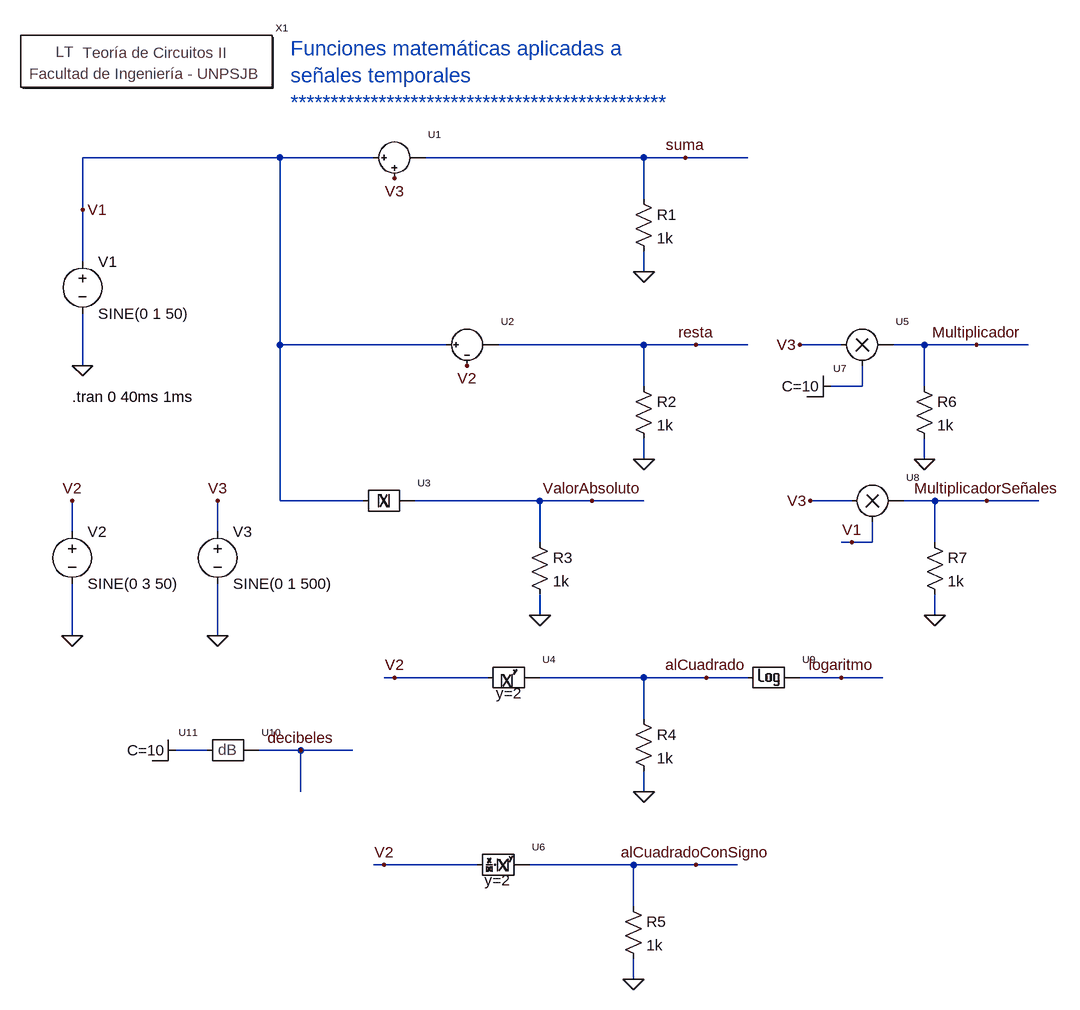
[diagram p0: schematic Prueba de funciones matematicas.asc]
Prueba de funciones matematicas.asc, the LTspice schematic file:
Version 4
SHEET 1 1132 1172
WIRE -256 -496 -560 -496
WIRE -112 -496 -256 -496
WIRE 304 -496 -32 -496
WIRE 368 -496 304 -496
WIRE 464 -496 368 -496
WIRE 304 -432 304 -496
WIRE -560 -416 -560 -496
WIRE -560 -336 -560 -416
WIRE 304 -320 304 -352
WIRE -256 -208 -256 -496
WIRE 0 -208 -256 -208
WIRE 304 -208 80 -208
WIRE 384 -208 304 -208
WIRE 464 -208 384 -208
WIRE 608 -208 544 -208
WIRE 736 -208 688 -208
WIRE 816 -208 736 -208
WIRE 896 -208 816 -208
WIRE -560 -176 -560 -256
WIRE 304 -144 304 -208
WIRE 640 -144 640 -176
WIRE 640 -144 592 -144
WIRE 736 -144 736 -208
WIRE 304 -32 304 -64
WIRE 736 -32 736 -64
WIRE -256 32 -256 -208
WIRE -128 32 -256 32
WIRE 144 32 -48 32
WIRE 224 32 144 32
WIRE 304 32 224 32
WIRE 624 32 560 32
WIRE 752 32 704 32
WIRE 832 32 752 32
WIRE 912 32 832 32
WIRE -576 80 -576 32
WIRE -352 80 -352 32
WIRE 144 96 144 32
WIRE 624 96 608 96
WIRE 656 96 656 64
WIRE 656 96 624 96
WIRE 752 96 752 32
WIRE 144 208 144 176
WIRE 752 208 752 176
WIRE -576 240 -576 160
WIRE -352 240 -352 160
WIRE -80 304 -96 304
WIRE 64 304 -80 304
WIRE 304 304 144 304
WIRE 400 304 304 304
WIRE 464 304 400 304
WIRE 608 304 544 304
WIRE 672 304 608 304
WIRE 304 368 304 304
WIRE -368 416 -416 416
WIRE -224 416 -288 416
WIRE -144 416 -224 416
WIRE -224 480 -224 416
WIRE 304 480 304 448
WIRE -96 592 -112 592
WIRE 48 592 -96 592
WIRE 288 592 128 592
WIRE 384 592 288 592
WIRE 448 592 384 592
WIRE 288 656 288 592
WIRE 288 768 288 736
FLAG -560 -176 0
FLAG -576 240 0
FLAG -352 240 0
FLAG -576 32 V2
FLAG -352 32 V3
FLAG -560 -416 V1
FLAG 304 -320 0
FLAG 304 -32 0
FLAG 144 208 0
FLAG 304 480 0
FLAG -80 -464 V3
FLAG 368 -496 suma
FLAG 32 -176 V2
FLAG 384 -208 resta
FLAG 224 32 ValorAbsoluto
FLAG 400 304 alCuadrado
FLAG -80 304 V2
FLAG 288 768 0
FLAG 384 592 alCuadradoConSigno
FLAG -96 592 V2
FLAG 736 -32 0
FLAG 816 -208 Multiplicador
FLAG 544 -208 V3
FLAG 752 208 0
FLAG 832 32 MultiplicadorSeñales
FLAG 560 32 V3
FLAG 624 96 V1
FLAG 608 304 logaritmo
FLAG -224 416 decibeles
SYMBOL voltage -560 -352 R0
WINDOW 123 0 0 Left 2
WINDOW 39 0 0 Left 2
SYMATTR InstName V1
SYMATTR Value SINE(0 1 50)
SYMBOL res 288 -448 R0
SYMATTR InstName R1
SYMATTR Value 1k
SYMBOL voltage -576 64 R0
WINDOW 123 0 0 Left 2
WINDOW 39 0 0 Left 2
SYMATTR InstName V2
SYMATTR Value SINE(0 3 50)
SYMBOL voltage -352 64 R0
WINDOW 123 0 0 Left 2
WINDOW 39 0 0 Left 2
SYMATTR InstName V3
SYMATTR Value SINE(0 1 500)
SYMBOL res 288 -160 R0
SYMATTR InstName R2
SYMATTR Value 1k
SYMBOL res 128 80 R0
SYMATTR InstName R3
SYMATTR Value 1k
SYMBOL res 288 352 R0
SYMATTR InstName R4
SYMATTR Value 1k
SYMBOL Suma -80 -496 R0
SYMATTR InstName U1
SYMBOL Restador 32 -208 R0
SYMATTR InstName U2
SYMBOL ValorAbsoluto -96 32 R0
SYMATTR InstName U3
SYMBOL Potencia 96 304 R0
SYMATTR SpiceLine y=2
SYMATTR InstName U4
SYMBOL res 272 640 R0
SYMATTR InstName R5
SYMATTR Value 1k
SYMBOL Potenciasigno 80 592 R0
SYMATTR SpiceLine y=2
SYMATTR InstName U6
SYMBOL Multiplicador 640 -208 R0
SYMATTR InstName U5
SYMBOL res 720 -160 R0
SYMATTR InstName R6
SYMATTR Value 1k
SYMBOL constantei 560 -144 R0
SYMATTR InstName U7
SYMBOL Multiplicador 656 32 R0
SYMATTR InstName U8
SYMBOL res 736 80 R0
SYMATTR InstName R7
SYMATTR Value 1k
SYMBOL Log 496 304 R0
SYMATTR InstName U9
SYMBOL dB -336 416 R0
SYMATTR Description Expresión en dB para relación de tensiones dB= 20*Logarítmo de base 10 (V2/V1)
SYMATTR InstName U10
SYMBOL constantei -448 416 R0
SYMATTR InstName U11
SYMBOL Circuitos2\\Letreros\\Teoría\ de\ Circuitos\ II -464 -640 R0
SYMATTR InstName X1
TEXT -576 -128 Left 2 !.tran 0 40ms 1ms
TEXT -240 -664 Left 3 ;Funciones matemáticas aplicadas a\nseñales temporales\n***********************************************

The netlist it stands for:
* Prueba de funciones matematicas.asc
V1 V1 0 SINE(0 1 50)
R1 suma 0 1k
V2 V2 0 SINE(0 3 50)
V3 V3 0 SINE(0 1 500)
R2 resta 0 1k
R3 ValorAbsoluto 0 1k
R4 alCuadrado 0 1k
XU1 V1 V3 suma Suma  ; pins in1 in2 out
XU2 V1 V2 resta Dif  ; pins in1 in2 out
XU3 V1 ValorAbsoluto Abs tripdt=1u  ; pins in out
XU4 V2 alCuadrado Pwr y=2 tripdt=1u  ; pins in out
R5 alCuadradoConSigno 0 1k
XU6 V2 alCuadradoConSigno Pwrs y=2 tripdt=1u  ; pins in out
XU5 V3 N001 Multiplicador Mult tripdt=1u  ; pins in1 in2 out
R6 Multiplicador 0 1k
XU7 N001 constante C=10  ; pins p
XU8 V3 V1 MultiplicadorSeñales Mult tripdt=1u  ; pins in1 in2 out
R7 MultiplicadorSeñales 0 1k
XU9 alCuadrado logaritmo Log  ; pins in out
XU10 N002 decibeles decibel  ; pins in out
XU11 N002 constante C=10  ; pins p
XX1 Teoría de Circuitos II
.tran 0 40ms 1ms
* Funciones matemáticas aplicadas a
* señales temporales
* ***********************************************
.lib ..\sym\Circuitos2\FuncionesMatematicas\funmate.lib
.backanno
.end